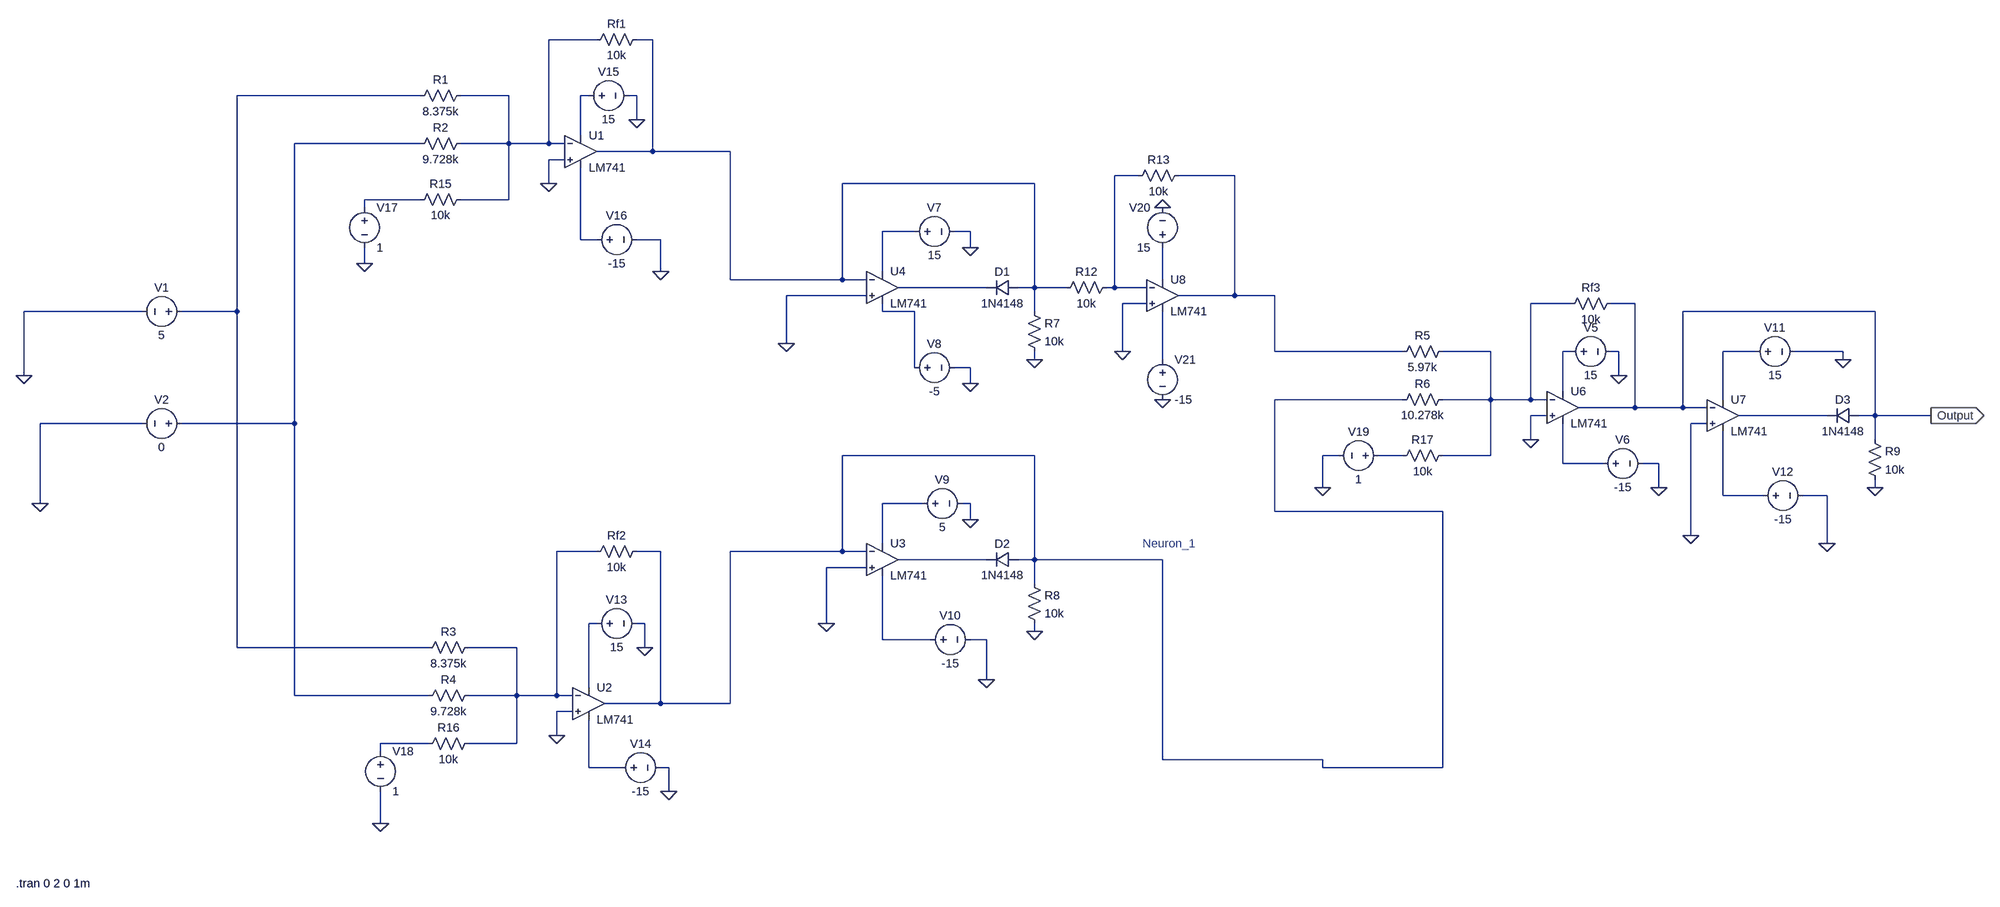
[diagram p0: schematic ANN5.asc]
ANN5.asc, the LTspice schematic file:
Version 4.1
SHEET 1 2796 1032
WIRE -16 -672 -112 -672
WIRE 96 -672 64 -672
WIRE -368 -560 -832 -560
WIRE -192 -560 -288 -560
WIRE -32 -560 -48 -560
WIRE 64 -560 48 -560
WIRE 64 -512 64 -560
WIRE -48 -480 -48 -560
WIRE -368 -464 -640 -464
WIRE -192 -464 -192 -560
WIRE -192 -464 -288 -464
WIRE -112 -464 -112 -672
WIRE -112 -464 -192 -464
WIRE -80 -464 -112 -464
WIRE 96 -448 96 -672
WIRE 96 -448 -16 -448
WIRE 256 -448 96 -448
WIRE -80 -432 -112 -432
WIRE 1072 -400 1024 -400
WIRE 1264 -400 1152 -400
WIRE -112 -384 -112 -432
WIRE 864 -384 480 -384
WIRE -368 -352 -480 -352
WIRE -192 -352 -192 -464
WIRE -192 -352 -288 -352
WIRE -480 -336 -480 -352
WIRE 624 -288 560 -288
WIRE 736 -288 704 -288
WIRE -48 -272 -48 -416
WIRE -16 -272 -48 -272
WIRE 112 -272 64 -272
WIRE 736 -256 736 -288
WIRE -480 -224 -480 -256
WIRE 112 -208 112 -272
WIRE 560 -208 560 -288
WIRE 256 -192 256 -448
WIRE 480 -192 480 -384
WIRE 480 -192 256 -192
WIRE 528 -192 480 -192
WIRE 1120 -192 1120 -256
WIRE 768 -176 592 -176
WIRE 864 -176 864 -384
WIRE 864 -176 832 -176
WIRE 928 -176 864 -176
WIRE 1024 -176 1024 -400
WIRE 1024 -176 1008 -176
WIRE 1088 -176 1024 -176
WIRE 528 -160 368 -160
WIRE 1264 -160 1264 -400
WIRE 1264 -160 1152 -160
WIRE 1344 -160 1264 -160
WIRE 1088 -144 1040 -144
WIRE 1936 -144 1856 -144
WIRE 2064 -144 2016 -144
WIRE -1072 -128 -1344 -128
WIRE -832 -128 -832 -560
WIRE -832 -128 -992 -128
WIRE 560 -128 560 -144
WIRE 624 -128 560 -128
WIRE 864 -128 864 -176
WIRE 2544 -128 2160 -128
WIRE 368 -64 368 -160
WIRE 1040 -48 1040 -144
WIRE 1344 -48 1344 -160
WIRE 1600 -48 1344 -48
WIRE 1776 -48 1680 -48
WIRE 1936 -48 1920 -48
WIRE 2032 -48 2016 -48
WIRE 2304 -48 2240 -48
WIRE 2480 -48 2384 -48
WIRE 864 -32 864 -48
WIRE 1120 -32 1120 -128
WIRE 2480 -32 2480 -48
WIRE 624 -16 624 -128
WIRE 736 -16 704 -16
WIRE -1344 0 -1344 -128
WIRE 2032 0 2032 -48
WIRE 736 16 736 -16
WIRE 1920 32 1920 -48
WIRE 1600 48 1344 48
WIRE 1776 48 1776 -48
WIRE 1776 48 1680 48
WIRE 1856 48 1856 -144
WIRE 1856 48 1776 48
WIRE 1888 48 1856 48
WIRE 2240 48 2240 -48
WIRE 2064 64 2064 -144
WIRE 2064 64 1952 64
WIRE 2160 64 2160 -128
WIRE 2160 64 2064 64
WIRE 2208 64 2160 64
WIRE 1888 80 1856 80
WIRE 2448 80 2272 80
WIRE 2544 80 2544 -128
WIRE 2544 80 2512 80
WIRE 2656 80 2544 80
WIRE -1072 96 -1312 96
WIRE -640 96 -640 -464
WIRE -640 96 -992 96
WIRE 2208 96 2176 96
WIRE 1856 128 1856 80
WIRE 2544 128 2544 80
WIRE 864 160 480 160
WIRE 1472 160 1440 160
WIRE 1600 160 1552 160
WIRE 1776 160 1776 48
WIRE 1776 160 1680 160
WIRE 1920 176 1920 96
WIRE 2000 176 1920 176
WIRE 2112 176 2080 176
WIRE 1440 224 1440 160
WIRE 2112 224 2112 176
WIRE 2544 224 2544 208
WIRE 2240 240 2240 112
WIRE 2320 240 2240 240
WIRE 2448 240 2400 240
WIRE -1312 256 -1312 96
WIRE 640 256 560 256
WIRE 736 256 720 256
WIRE 1344 272 1344 48
WIRE 1680 272 1344 272
WIRE 736 288 736 256
WIRE 2176 320 2176 96
WIRE 560 336 560 256
WIRE 2448 336 2448 240
WIRE -16 352 -96 352
WIRE 112 352 64 352
WIRE 480 352 480 160
WIRE 480 352 256 352
WIRE 528 352 480 352
WIRE 768 368 592 368
WIRE 864 368 864 160
WIRE 864 368 832 368
WIRE 1120 368 864 368
WIRE 528 384 448 384
WIRE 864 416 864 368
WIRE -16 496 -32 496
WIRE 80 496 64 496
WIRE 448 496 448 384
WIRE 864 512 864 496
WIRE 560 528 560 400
WIRE 656 528 560 528
WIRE 768 528 736 528
WIRE -832 544 -832 -128
WIRE -352 544 -832 544
WIRE -176 544 -272 544
WIRE 80 544 80 496
WIRE 768 608 768 528
WIRE -32 624 -32 496
WIRE -640 640 -640 96
WIRE -352 640 -640 640
WIRE -176 640 -176 544
WIRE -176 640 -272 640
WIRE -96 640 -96 352
WIRE -96 640 -176 640
WIRE -64 640 -96 640
WIRE 112 656 112 352
WIRE 112 656 0 656
WIRE 256 656 256 352
WIRE 256 656 112 656
WIRE -64 672 -96 672
WIRE -96 720 -96 672
WIRE -352 736 -448 736
WIRE -176 736 -176 640
WIRE -176 736 -272 736
WIRE -448 752 -448 736
WIRE 1120 768 1120 368
WIRE 1440 768 1120 768
WIRE -32 784 -32 688
WIRE 32 784 -32 784
WIRE 128 784 112 784
WIRE 1440 784 1440 768
WIRE 1680 784 1680 272
WIRE 1680 784 1440 784
WIRE 128 832 128 784
WIRE -448 896 -448 832
FLAG -112 -384 0
FLAG -96 720 0
FLAG 1856 128 0
FLAG 864 -32 0
FLAG 864 512 0
FLAG 2544 224 0
FLAG 2656 80 Output
IOPIN 2656 80 Out
FLAG -1312 256 0
FLAG -1344 0 0
FLAG 2032 0 0
FLAG 2112 224 0
FLAG 736 -256 0
FLAG 768 608 0
FLAG 112 -208 0
FLAG 64 -512 0
FLAG 80 544 0
FLAG 128 832 0
FLAG 736 16 0
FLAG 2448 336 0
FLAG 2480 -32 0
FLAG 368 -64 0
FLAG 448 496 0
FLAG 2176 320 0
FLAG 736 288 0
FLAG -480 -224 0
FLAG -448 896 0
FLAG 1440 224 0
FLAG 1120 48 0
FLAG 1040 -48 0
FLAG 1120 -336 0
SYMBOL voltage -976 -128 R90
WINDOW 0 -32 56 VBottom 2
WINDOW 3 32 56 VTop 2
WINDOW 123 0 0 Left 0
WINDOW 39 0 0 Left 0
SYMATTR InstName V1
SYMATTR Value 5
SYMBOL voltage -976 96 R90
WINDOW 0 -32 56 VBottom 2
WINDOW 3 32 56 VTop 2
WINDOW 123 0 0 Left 0
WINDOW 39 0 0 Left 0
SYMATTR InstName V2
SYMATTR Value 0
SYMBOL res -272 -576 R90
WINDOW 0 0 56 VBottom 2
WINDOW 3 32 56 VTop 2
SYMATTR InstName R1
SYMATTR Value 8.375k
SYMBOL res -272 -480 R90
WINDOW 0 0 56 VBottom 2
WINDOW 3 32 56 VTop 2
SYMATTR InstName R2
SYMATTR Value 9.728k
SYMBOL res 80 -688 R90
WINDOW 0 0 56 VBottom 2
WINDOW 3 32 56 VTop 2
SYMATTR InstName Rf1
SYMATTR Value 10k
SYMBOL res -256 528 R90
WINDOW 0 0 56 VBottom 2
WINDOW 3 32 56 VTop 2
SYMATTR InstName R3
SYMATTR Value 8.375k
SYMBOL res -256 624 R90
WINDOW 0 0 56 VBottom 2
WINDOW 3 32 56 VTop 2
SYMATTR InstName R4
SYMATTR Value 9.728k
SYMBOL res 80 336 R90
WINDOW 0 0 56 VBottom 2
WINDOW 3 32 56 VTop 2
SYMATTR InstName Rf2
SYMATTR Value 10k
SYMBOL res 1696 -64 R90
WINDOW 0 0 56 VBottom 2
WINDOW 3 32 56 VTop 2
SYMATTR InstName R5
SYMATTR Value 5.97k
SYMBOL res 1696 32 R90
WINDOW 0 0 56 VBottom 2
WINDOW 3 32 56 VTop 2
SYMATTR InstName R6
SYMATTR Value 10.278k
SYMBOL res 2032 -160 R90
WINDOW 0 0 56 VBottom 2
WINDOW 3 32 56 VTop 2
SYMATTR InstName Rf3
SYMATTR Value 10k
SYMBOL res 848 -144 R0
SYMATTR InstName R7
SYMATTR Value 10k
SYMBOL res 848 400 R0
SYMATTR InstName R8
SYMATTR Value 10k
SYMBOL res 2528 112 R0
SYMATTR InstName R9
SYMATTR Value 10k
SYMBOL voltage 1920 -48 R270
WINDOW 0 32 56 VTop 2
WINDOW 3 -32 56 VBottom 2
WINDOW 123 0 0 Left 0
WINDOW 39 0 0 Left 0
SYMATTR InstName V5
SYMATTR Value 15
SYMBOL voltage 1984 176 R270
WINDOW 0 32 56 VTop 2
WINDOW 3 -32 56 VBottom 2
WINDOW 123 0 0 Left 0
WINDOW 39 0 0 Left 0
SYMATTR InstName V6
SYMATTR Value -15
SYMBOL voltage 608 -288 R270
WINDOW 0 32 56 VTop 2
WINDOW 3 -32 56 VBottom 2
WINDOW 123 0 0 Left 0
WINDOW 39 0 0 Left 0
SYMATTR InstName V7
SYMATTR Value 15
SYMBOL voltage 608 -16 R270
WINDOW 0 32 56 VTop 2
WINDOW 3 -32 56 VBottom 2
WINDOW 123 0 0 Left 0
WINDOW 39 0 0 Left 0
SYMATTR InstName V8
SYMATTR Value -5
SYMBOL voltage 624 256 R270
WINDOW 0 32 56 VTop 2
WINDOW 3 -32 56 VBottom 2
WINDOW 123 0 0 Left 0
WINDOW 39 0 0 Left 0
SYMATTR InstName V9
SYMATTR Value 5
SYMBOL voltage 640 528 R270
WINDOW 0 32 56 VTop 2
WINDOW 3 -32 56 VBottom 2
WINDOW 123 0 0 Left 0
WINDOW 39 0 0 Left 0
SYMATTR InstName V10
SYMATTR Value -15
SYMBOL voltage 2288 -48 R270
WINDOW 0 32 56 VTop 2
WINDOW 3 -32 56 VBottom 2
WINDOW 123 0 0 Left 0
WINDOW 39 0 0 Left 0
SYMATTR InstName V11
SYMATTR Value 15
SYMBOL voltage 2304 240 R270
WINDOW 0 32 56 VTop 2
WINDOW 3 -32 56 VBottom 2
WINDOW 123 0 0 Left 0
WINDOW 39 0 0 Left 0
SYMATTR InstName V12
SYMATTR Value -15
SYMBOL voltage -32 496 R270
WINDOW 0 32 56 VTop 2
WINDOW 3 -32 56 VBottom 2
WINDOW 123 0 0 Left 0
WINDOW 39 0 0 Left 0
SYMATTR InstName V13
SYMATTR Value 15
SYMBOL voltage 16 784 R270
WINDOW 0 32 56 VTop 2
WINDOW 3 -32 56 VBottom 2
WINDOW 123 0 0 Left 0
WINDOW 39 0 0 Left 0
SYMATTR InstName V14
SYMATTR Value -15
SYMBOL voltage -48 -560 R270
WINDOW 0 32 56 VTop 2
WINDOW 3 -32 56 VBottom 2
WINDOW 123 0 0 Left 0
WINDOW 39 0 0 Left 0
SYMATTR InstName V15
SYMATTR Value 15
SYMBOL voltage -32 -272 R270
WINDOW 0 32 56 VTop 2
WINDOW 3 -32 56 VBottom 2
SYMATTR InstName V16
SYMATTR Value -15
SYMBOL voltage -480 -352 R0
SYMATTR InstName V17
SYMATTR Value 1
SYMBOL res -272 -368 R90
WINDOW 0 0 56 VBottom 2
WINDOW 3 32 56 VTop 2
SYMATTR InstName R15
SYMATTR Value 10k
SYMBOL voltage -448 736 R0
SYMATTR InstName V18
SYMATTR Value 1
SYMBOL res -256 720 R90
WINDOW 0 0 56 VBottom 2
WINDOW 3 32 56 VTop 2
SYMATTR InstName R16
SYMATTR Value 10k
SYMBOL res 1696 144 R90
WINDOW 0 0 56 VBottom 2
WINDOW 3 32 56 VTop 2
SYMATTR InstName R17
SYMATTR Value 10k
SYMBOL voltage 1568 160 R90
WINDOW 0 -32 56 VBottom 2
WINDOW 3 32 56 VTop 2
SYMATTR InstName V19
SYMATTR Value 1
SYMBOL LM741 -48 -512 R0
SYMATTR InstName U1
SYMBOL LM741 -32 592 R0
SYMATTR InstName U2
SYMBOL LM741 560 304 R0
SYMATTR InstName U3
SYMBOL LM741 560 -240 R0
SYMATTR InstName U4
SYMBOL LM741 1920 0 R0
SYMATTR InstName U6
SYMBOL LM741 2240 16 R0
SYMATTR InstName U7
SYMBOL diode 832 -192 R90
WINDOW 0 0 32 VBottom 2
WINDOW 3 32 32 VTop 2
SYMATTR InstName D1
SYMATTR Value 1N4148
SYMBOL diode 832 352 R90
WINDOW 0 0 32 VBottom 2
WINDOW 3 32 32 VTop 2
SYMATTR InstName D2
SYMATTR Value 1N4148
SYMBOL diode 2512 64 R90
WINDOW 0 0 32 VBottom 2
WINDOW 3 32 32 VTop 2
SYMATTR InstName D3
SYMATTR Value 1N4148
SYMBOL LM741 1120 -224 R0
SYMATTR InstName U8
SYMBOL res 1024 -192 R90
WINDOW 0 0 56 VBottom 2
WINDOW 3 32 56 VTop 2
SYMATTR InstName R12
SYMATTR Value 10k
SYMBOL res 1168 -416 R90
WINDOW 0 0 56 VBottom 2
WINDOW 3 32 56 VTop 2
SYMATTR InstName R13
SYMATTR Value 10k
SYMBOL voltage 1120 -240 R180
WINDOW 0 24 96 Left 2
WINDOW 3 24 16 Left 2
SYMATTR InstName V20
SYMATTR Value 15
SYMBOL voltage 1120 -48 R0
SYMATTR InstName V21
SYMATTR Value -15
TEXT 1080 336 Left 2 ;Neuron_1
TEXT -1360 1016 Left 2 !.tran 0 2 0 1m

The netlist it stands for:
* ANN5.asc
V1 N003 0 5
V2 N005 0 0
R1 N001 N003 8.375k
R2 N001 N005 9.728k
Rf1 N002 N001 10k
R3 N024 N003 8.375k
R4 N024 N005 9.728k
Rf2 N018 N024 10k
R5 N013 N007 5.97k
R6 N013 N018 10.278k
Rf3 Output N013 10k
R7 N002 0 10k
R8 N018 0 10k
R9 Output 0 10k
V5 N015 0 15
V6 N021 0 -15
V7 N009 0 15
V8 N014 0 -5
V9 N023 0 5
V10 N027 0 -15
V11 N016 0 15
V12 N022 0 -15
V13 N026 0 15
V14 N029 0 -15
V15 N004 0 15
V16 N010 0 -15
V17 N008 0 1
R15 N001 N008 10k
V18 N028 0 1
R16 N024 N028 10k
R17 N013 N020 10k
V19 N020 0 1
X§U1 0 N001 N004 N010 N002 LM741  ; pins In+ In- V+ V- OUT
X§U2 0 N024 N026 N029 N018 LM741  ; pins In+ In- V+ V- OUT
X§U3 0 N018 N023 N027 N025 LM741  ; pins In+ In- V+ V- OUT
X§U4 0 N002 N009 N014 N012 LM741  ; pins In+ In- V+ V- OUT
X§U6 0 N013 N015 N021 Output LM741  ; pins In+ In- V+ V- OUT
X§U7 0 Output N016 N022 N019 LM741  ; pins In+ In- V+ V- OUT
D1 N002 N012 1N4148
D2 N018 N025 1N4148
D3 Output N019 1N4148
X§U8 0 N006 N011 N017 N007 LM741  ; pins In+ In- V+ V- OUT
R12 N006 N002 10k
R13 N007 N006 10k
V20 N011 0 15
V21 N017 0 -15
.model D D
.lib standard.dio
* Neuron_1
.tran 0 2 0 1m
.lib LM741.lib
.backanno
.end